# EAGLE design RC_Engine_Sound_ESP32_B (EAGLE 9.6.2)
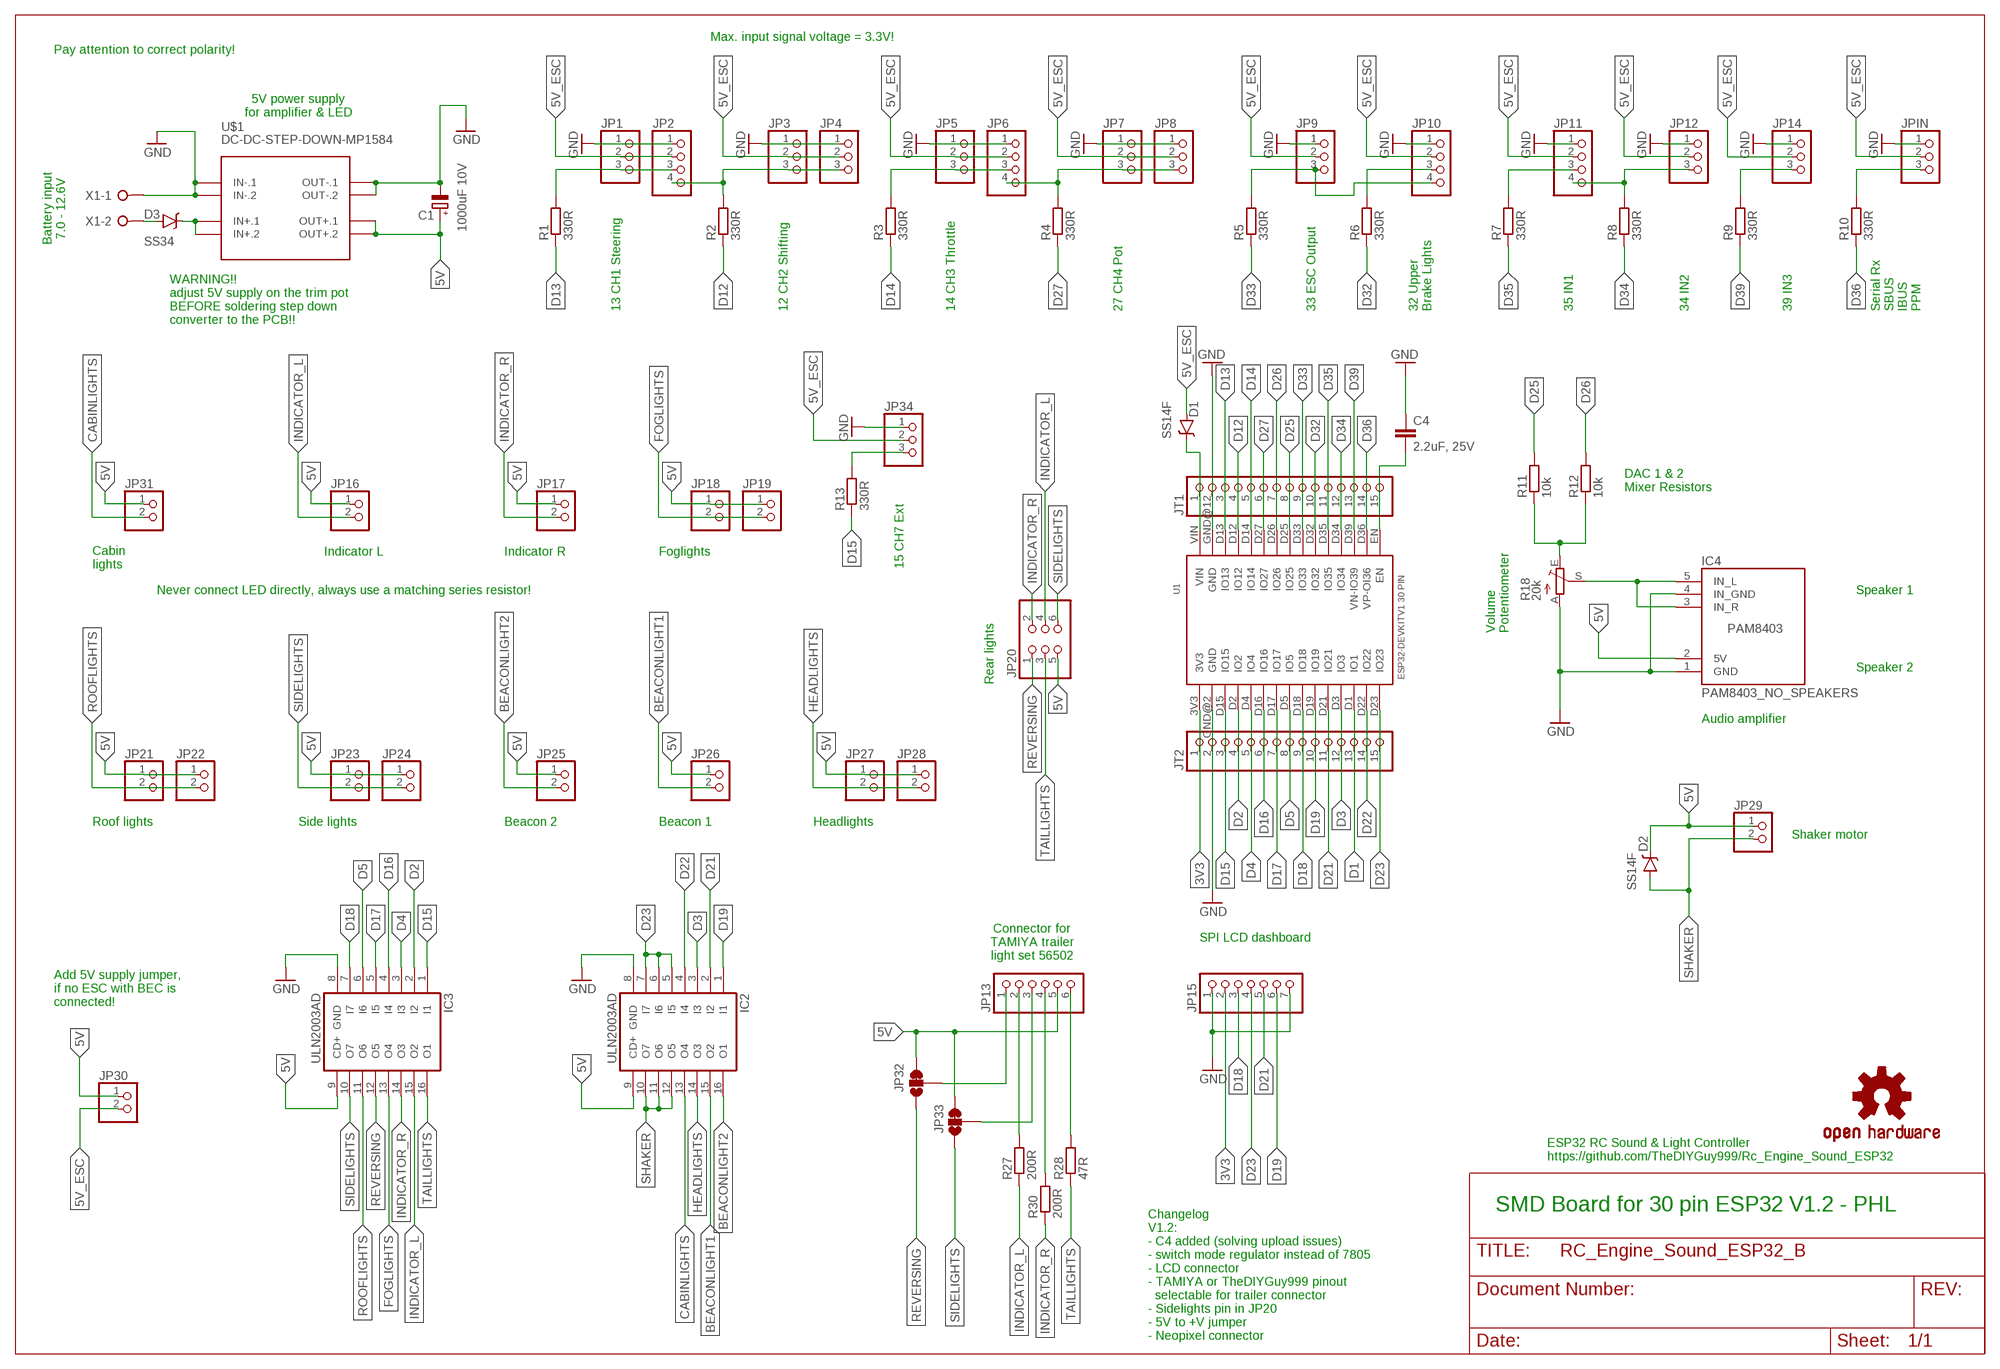
[diagram p0: schematic, sheet 1]

## Parts
C1  1000uF 10V  CPOL-EUUD-10X10  [UD-10X10_NICHICON]
C4  2.2uF, 25V  C-EUC1206  [C1206]
D1  SS14F  MBRA140  [SMA-DIODE]
D2  SS14F  MBRA140  [SMA-DIODE]
D3  SS34  MBRA140  [SMA-DIODE]
IC2  ULN2003AD  [SO16]
IC3  ULN2003AD  [SO16]
IC4  PAM8403_NO_SPEAKERS  [PAM8403_NO_SPEAKERS]
JP1  PINHD-1X3  [1X03]
JP2  00_CUSTOM_PINHEAD_PINHD-1X4  [00_CUSTOM_PINHEAD_1X04]
JP3  PINHD-1X3  [1X03]
JP4  PINHD-1X3  [1X03]
JP5  PINHD-1X3  [1X03]
JP6  00_CUSTOM_PINHEAD_PINHD-1X4  [00_CUSTOM_PINHEAD_1X04]
JP7  PINHD-1X3  [1X03]
JP8  PINHD-1X3  [1X03]
JP9  PINHD-1X3  [1X03]
JP10  00_CUSTOM_PINHEAD_PINHD-1X4  [00_CUSTOM_PINHEAD_1X04]
JP11  00_CUSTOM_PINHEAD_PINHD-1X4  [00_CUSTOM_PINHEAD_1X04]
JP12  PINHD-1X3  [1X03]
JP13  PINHD-1X6  [1X06]
JP14  PINHD-1X3  [1X03]
JP15  PINHD-1X7  [1X07]
JP16  PINHD-1X2  [1X02]
JP17  PINHD-1X2  [1X02]
JP18  PINHD-1X2  [1X02]
JP19  PINHD-1X2  [1X02]
JP20  PINHD-2X3  [2X03]
JP21  PINHD-1X2  [1X02]
JP22  PINHD-1X2  [1X02]
JP23  PINHD-1X2  [1X02]
JP24  PINHD-1X2  [1X02]
JP25  PINHD-1X2  [1X02]
JP26  PINHD-1X2  [1X02]
JP27  PINHD-1X2  [1X02]
JP28  PINHD-1X2  [1X02]
JP29  PINHD-1X2  [1X02]
JP30  PINHD-1X2  [1X02]
JP31  PINHD-1X2  [1X02]
JP32  JUMPER-PAD-3-2OF3_NC_BY_TRACE_LARGE  [PAD-JUMPER-3-2OF3_NC_BY_TRACE_YES_SILK_LARGE]
JP33  JUMPER-PAD-3-2OF3_NC_BY_TRACE_LARGE  [PAD-JUMPER-3-2OF3_NC_BY_TRACE_YES_SILK_LARGE]
JP34  PINHD-1X3  [1X03]
JPIN  PINHD-1X3  [1X03]
JT1  00_CUSTOM_PINHEAD_PINHD-1X15  [00_CUSTOM_PINHEAD_1X15]
JT2  00_CUSTOM_PINHEAD_PINHD-1X15  [00_CUSTOM_PINHEAD_1X15]
LOGO1  OSHW-LOGOM  [OSHW-LOGO-M]
R1  330R  R-EU_R0805  [R0805]
R2  330R  R-EU_R0805  [R0805]
R3  330R  R-EU_R0805  [R0805]
R4  330R  R-EU_R0805  [R0805]
R5  330R  R-EU_R0805  [R0805]
R6  330R  R-EU_R0805  [R0805]
R7  330R  R-EU_R0805  [R0805]
R8  330R  R-EU_R0805  [R0805]
R9  330R  R-EU_R0805  [R0805]
R10  330R  R-EU_R0805  [R0805]
R11  10k  R-EU_R0805  [R0805]
R12  10k  R-EU_R0805  [R0805]
R13  330R  R-EU_R0805  [R0805]
R18  20k  TRIM_EU-S64W  [S64W]
R27  200R  R-EU_R0805  [R0805]
R28  47R  R-EU_R0805  [R0805]
R30  200R  R-EU_R0805  [R0805]
U1  ESP32DEVKITV1  [ESP32-DEVKITV1]
U$1  DC-DC-STEP-DOWN-MP1584  [DC-DC-STEP-DOWN-MP1584]
X1  W237-02P  [W237-132]

## Nets
3V3: JP15.2 JT2.1 U1.3V3
5V: C1.+ D2.C IC2.9(CD+) IC3.9(CD+) IC4.2(5V) JP13.5 JP16.1 JP17.1 JP18.1 JP19.1 JP20.5 JP21.1 JP22.1 JP23.1 JP24.1 JP25.1 JP26.1 JP27.1 JP28.1 JP29.1 JP30.1 JP31.1 JP32.3 JP33.3 U$1.OUT+.1 U$1.OUT+.2
5V_ESC: D1.A JP1.2 JP2.2 JP3.2 JP4.2 JP5.2 JP6.2 JP7.2 JP8.2 JP9.2 JP10.2 JP11.2 JP12.2 JP14.2 JP30.2 JP34.2 JPIN.2
BEACONLIGHT1: IC2.15(O2) JP26.2
BEACONLIGHT2: IC2.16(O1) JP25.2
CABINLIGHTS: IC2.13(O4) JP31.2
D1: JT2.13 U1.D1(IO1)
D2: IC3.2(I2) JT2.4 U1.D2(IO2)
D3: IC2.3(I3) JT2.12 U1.D3(IO3)
D4: IC3.3(I3) JT2.5 U1.D4(IO4)
D5: IC3.6(I6) JT2.8 U1.D5(IO5)
D12: JT1.4 R2.1 U1.D12(IO12)
D13: JT1.3 R1.1 U1.D13(IO13)
D14: JT1.5 R3.1 U1.D14(IO14)
D15: IC3.1(I1) JT2.3 R13.1 U1.D15(IO15)
D16: IC3.4(I4) JT2.6 U1.D16(IO16)
D17: IC3.5(I5) JT2.7 U1.D17(IO17)
D18: IC3.7(I7) JP15.3 JT2.9 U1.D18(IO18)
D19: IC2.1(I1) JP15.6 JT2.10 U1.D19(IO19)
D21: IC2.2(I2) JP15.5 JT2.11 U1.D21(IO21)
D22: IC2.4(I4) JT2.14 U1.D22(IO22)
D23: IC2.5(I5) IC2.6(I6) IC2.7(I7) JP15.4 JT2.15 U1.D23(IO23)
D25: JT1.8 R11.2 U1.D25(IO25)
D26: JT1.7 R12.2 U1.D26(IO26)
D27: JT1.6 R4.1 U1.D27(IO27)
D32: JT1.10 R6.1 U1.D32(IO32)
D33: JT1.9 R5.1 U1.D33(IO33)
D34: JT1.12 R8.1 U1.D34(IO34)
D35: JT1.11 R7.1 U1.D35(IO35)
D36: JT1.14 R10.1 U1.D36(VP-OI36)
D39: JT1.13 R9.1 U1.D39(VN-IO39)
FOGLIGHTS: IC3.13(O4) JP18.2 JP19.2
GND: C1.- C4.1 IC2.8(GND) IC3.8(GND) IC4.1(GND) IC4.4(IN_GND) JP1.1 JP2.1 JP3.1 JP4.1 JP5.1 JP6.1 JP7.1 JP8.1 JP9.1 JP10.1 JP11.1 JP12.1 JP14.1 JP15.1 JP15.7 JP34.1 JPIN.1 JT1.2 JT2.2 R18.A U1.GND@1(GND) U1.GND@2(GND) U$1.IN-.1 U$1.IN-.2 U$1.OUT-.1 U$1.OUT-.2 X1.1
HEADLIGHTS: IC2.14(O3) JP27.2 JP28.2
INDICATOR_L: IC3.15(O2) JP16.2 JP20.4 R27.1
INDICATOR_R: IC3.14(O3) JP17.2 JP20.2 R30.1
N$1: IC4.3(IN_R) IC4.5(IN_L) R18.S
N$2: R11.1 R12.1 R18.E
N$3: JP1.3 JP2.3 R1.2
N$4: JP13.6 R28.2
N$5: JP2.4 JP3.3 JP4.3 R2.2
N$6: JP5.3 JP6.3 R3.2
N$7: JP6.4 JP7.3 JP8.3 R4.2
N$8: JP9.3 JP10.4 R5.2
N$9: D1.C JT1.1 U1.VIN
N$10: JP10.3 R6.2
N$11: JP11.3 R7.2
N$12: JP11.4 JP12.3 R8.2
N$13: JP13.4 R30.2
N$14: JPIN.3 R10.2
N$15: JP13.2 R27.2
N$16: JP13.1 JP32.2
N$17: C4.2 JT1.15 U1.EN
N$18: JP13.3 JP33.2
N$19: D3.C U$1.IN+.1 U$1.IN+.2
N$20: D3.A X1.2
N$21: JP14.3 R9.2
N$23: JP34.3 R13.2
REVERSING: IC3.12(O5) JP20.1 JP32.1
ROOFLIGHTS: IC3.11(O6) JP21.2 JP22.2
SHAKER: D2.A IC2.10(O7) IC2.11(O6) IC2.12(O5) JP29.2
SIDELIGHTS: IC3.10(O7) JP20.6 JP23.2 JP24.2 JP33.1
TAILLIGHTS: IC3.16(O1) JP20.3 R28.1

## Notes on the sheet
- Max. input signal voltage = 3.3V!
- Pay attention to correct polarity!
- 5V power supply
  for amplifier & LED
- Battery input
  7.0 - 12.6V
- 13 CH1 Steering | 12 CH2 Shifting | 14 CH3 Throttle | 27 CH4 Pot | 33 ESC Output
- 32 Upper
  Brake Lights
- 35 IN1 | 34 IN2 | 39 IN3
- Serial Rx
  SBUS
  IBUS
  PPM
- WARNING!!
  adjust 5V supply on the trim pot
  BEFORE soldering step down
  converter to the PCB!!
- DAC 1 & 2
  Mixer Resistors
- Indicator L | Indicator R | Foglights
- Cabin
  lights
- 15 CH7 Ext
- Never connect LED directly, always use a matching series resistor! | Speaker 1
- Volume
  Potentiometer
- Speaker 2
- Rear lights
- Audio amplifier
- Roof lights | Side lights | Beacon 2 | Beacon 1 | Headlights
- Shaker motor
- Connector for
  TAMIYA trailer
  light set 56502
- SPI LCD dashboard
- Add 5V supply jumper,
  if no ESC with BEC is
  connected!
- ESP32 RC Sound & Light Controller
  https://github.com/TheDIYGuy999/Rc_Engine_Sound_ESP32
- SMD Board for 30 pin ESP32 V1.2 - PHL
- Changelog
  V1.2:
  - C4 added (solving upload issues)
  - switch mode regulator instead of 7805
  - LCD connector
  - TAMIYA or TheDIYGuy999 pinout
    selectable for trailer connector
  - Sidelights pin in JP20
  - 5V to +V jumper
  - Neopixel connector

## Library data of the parts
C1 = rcl:CPOL-EU: POLARIZED CAPACITOR, European symbol; SPICEPREFIX: C
C4 = rcl:C-EU: CAPACITOR, European symbol
D1-D3 = SparkFun-DiscreteSemi:MBRA140: 40V, 1A Schottky rectifier SMA/DO-214AC package DIO-08053; PROD_ID: DIO-08053
IC2 IC3 = uln-udn:ULN2003A: DRIVER ARRAY
IC4 = 00_custom:PAM8403_NO_SPEAKERS
JP1 JP3-JP5 JP7-JP9 JP12 JP14 JP34 JPIN = 00_custom_pinhead:PINHD-1X3: PIN HEADER
JP2 JP6 JP10 JP11 = RC_Engine_Sound_ESP32:00_CUSTOM_PINHEAD_PINHD-1X4: PIN HEADER
JP13 = 00_custom_pinhead:PINHD-1X6: PIN HEADER
JP15 = 00_custom_pinhead:PINHD-1X7: PIN HEADER
JP16-JP19 JP21-JP31 = 00_custom_pinhead:PINHD-1X2: PIN HEADER
JP20 = 00_custom_pinhead:PINHD-2X3: PIN HEADER
JP32 JP33 = SparkFun-Passives:JUMPER-PAD-3-2OF3_NC_BY_TRACE
JT1 JT2 = RC_Engine_Sound_ESP32:00_CUSTOM_PINHEAD_PINHD-1X15
LOGO1 = SparkFun-Aesthetics:OSHW-LOGO: Open Source Hardware Logo This logo indicates the piece of hardware it is found on incorporates a OSHW license and/or adheres to the definition of open source hardware found here: http://freedomdefined.org/OSHW
R1-R13 R27 R28 R30 = rcl:R-EU_: RESISTOR, European symbol; SPICEPREFIX: R
R18 = pot:TRIM_EU-: POTENTIOMETER
U1 = ESP32-DEVKITV1_30pin:ESP32DEVKITV1
U$1 = 00_custom:DC-DC-STEP-DOWN-MP1584: DC/DC Step-Down Regulator based on MP1584 chip MP1584 datasheet available here: http://www.haoyuelectronics.com/Attachment/MP1584/MP1584.pdf Click here to find device on ebay.com <http://www.ebay.com/sch/mp1584+module>
X1 = con-wago-508:W237-02P: WAGO SREW CLAMP; OC_FARNELL: unknown; OC_NEWARK: unknown

## Net classes
0 5V: clearance 0.254 mm

## Board
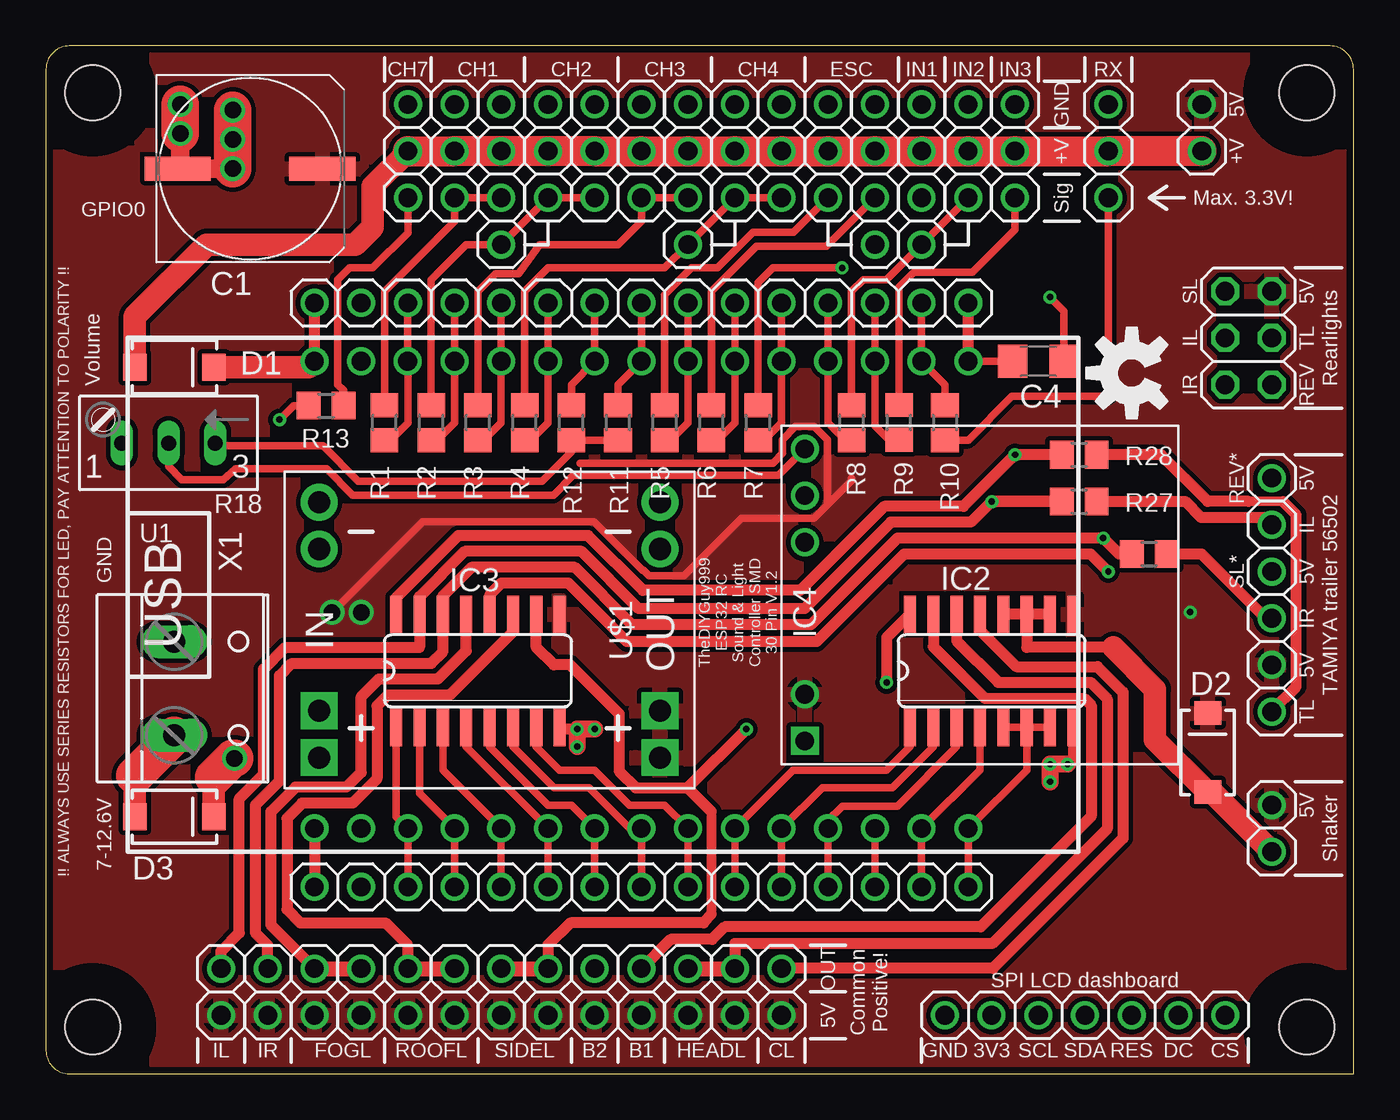
[diagram p1: board, top side]
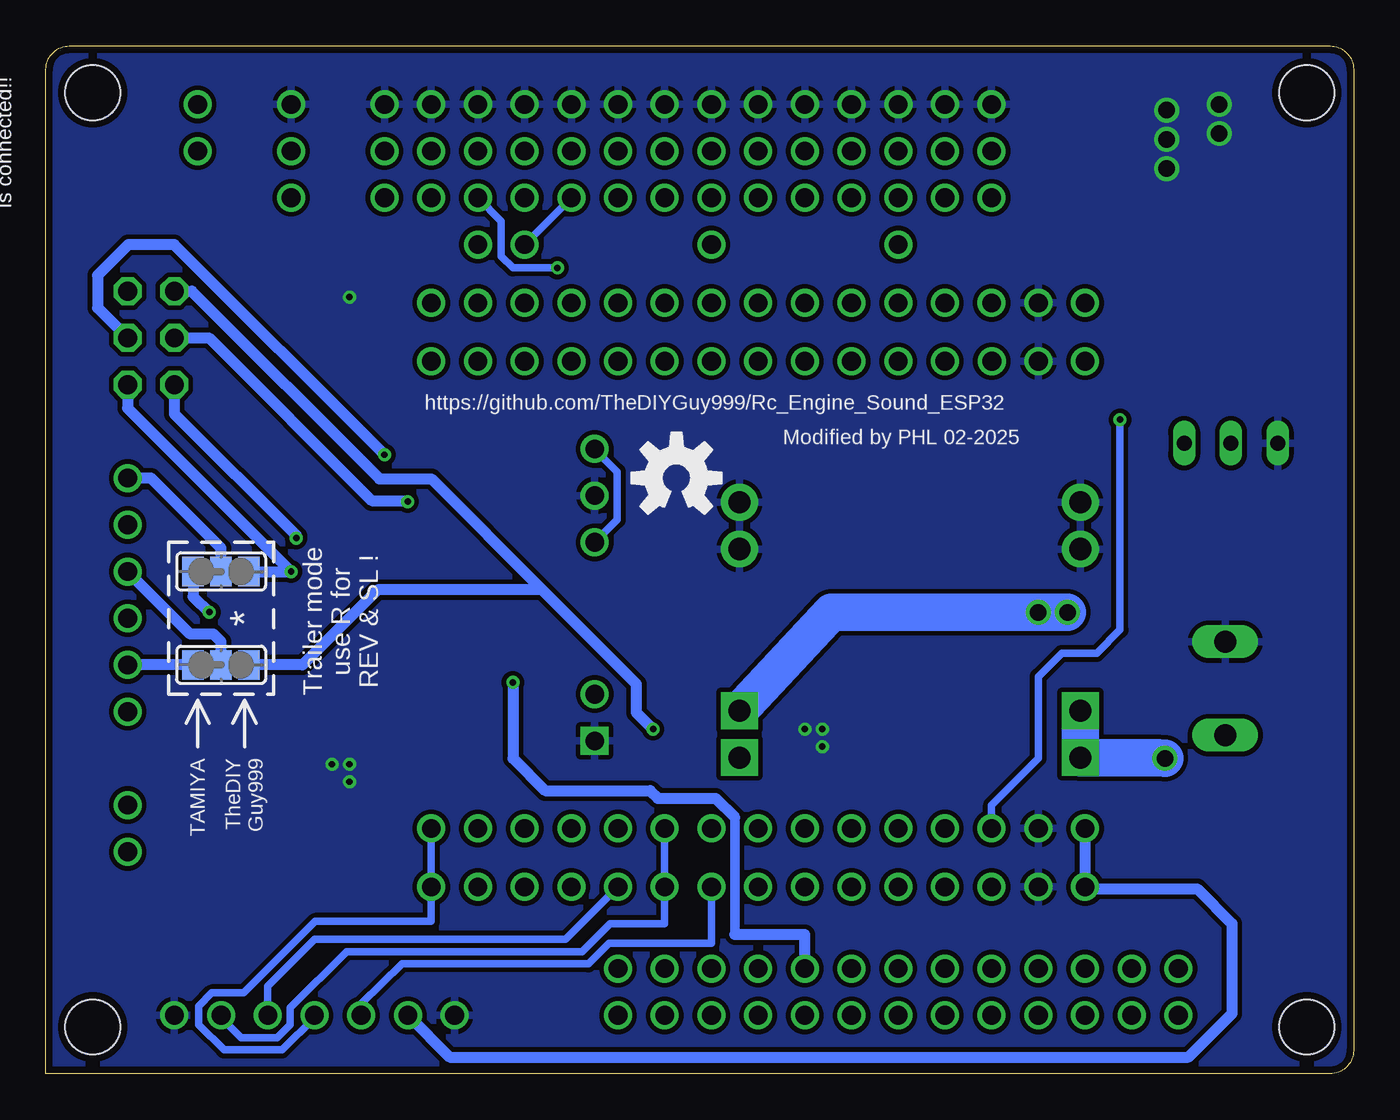
[diagram p2: board, bottom side, seen from below]

Size 71.12 x 55.88 mm. Coordinates in mm from the lower left corner, seen from the top.
Outline: 0,54.61 0,1.27 arc90 1.27,0 71.12,0 71.12,54.61 arc90 69.85,55.88 1.27,55.88 arc90 0,54.61
Copper layers (1*16): Top 0.0356mm / dielectric 1.5011mm / Bottom 0.0356mm
Design rules "OSHPark_LaenPCBOrder": minimum track width 6mil, minimum drill 13mil, track to track 6mil, track to pad 6mil, pad to pad 6mil, via to via 6mil, smd to smd 6mil, copper to edge 15mil, drill to drill 6mil, minimum pad ring 7mil, minimum via ring 7mil, stop-mask expansion 3mil, vias tented up to drill 0mil, thermal gap 10mil
Holes 3 mm at 2.54,53.34 2.54,2.54 68.58,2.54 68.58,53.34
tRestrict: area -0.7,50.1 to 5.8,56.6; area 65.3,50.1 to 71.8,56.6; area 65.3,-0.7 to 71.8,5.8; area -0.7,-0.7 to 5.8,5.8

### Footprints (pad centres in the part's own frame; a part is rotated, then mirrored left to right if it is on the bottom)
UD-10X10_NICHICON = smd 3.6 x 1.3: + 3.925,0; - -3.95,0
C1206 = smd 1.6 x 1.8: 1 -1.4,0; 2 1.4,0
SMA-DIODE = smd 1.27 x 1.47: A -2.15,0; C 2.15,0
SO16 = smd 0.66 x 2.032: 1 -4.445,-3.073; 2 -3.175,-3.073; 3 -1.905,-3.073; 4 -0.635,-3.073; 5 0.635,-3.073; 6 1.905,-3.073; 7 3.175,-3.073; 8 4.445,-3.073; 9 4.445,3.073; 10 3.175,3.073; 11 1.905,3.073; 12 0.635,3.073; 13 -0.635,3.073; 14 -1.905,3.073; 15 -3.175,3.073; 16 -4.445,3.073
PAM8403_NO_SPEAKERS = drill 1.016 square: 1 -7.62,8.89 | drill 1.016: 2 -5.08,8.89; 3 3.175,8.89; 4 5.715,8.89; 5 8.255,8.89
1X03 = drill 1.016 pad 1.524: 1 -2.54,0; 2 0,0; 3 2.54,0
00_CUSTOM_PINHEAD_1X04 = drill 1.016 pad 1.524: 1 -2.54,0; 2 0,0; 3 2.54,0; 4 5.08,0
1X06 = drill 1.016 pad 1.524: 1 -6.35,0; 2 -3.81,0; 3 -1.27,0; 4 1.27,0; 5 3.81,0; 6 6.35,0
1X07 = drill 1.016: 1 -7.62,0; 2 -5.08,0; 3 -2.54,0; 4 0,0; 5 2.54,0; 6 5.08,0; 7 7.62,0
1X02 = drill 1.016 pad 1.524: 1 -1.27,0; 2 1.27,0
2X03 = drill 1.016 octagon: 1 -2.54,-1.27; 2 -2.54,1.27; 3 0,-1.27; 4 0,1.27; 5 2.54,-1.27; 6 2.54,1.27
PAD-JUMPER-3-2OF3_NC_BY_TRACE_YES_SILK_LARGE = smd 1.168 x 1.6: 1 -1.524,0; 2 0,0; 3 1.524,0
00_CUSTOM_PINHEAD_1X15 = drill 1.016: 1 -7.62,0; 2 -5.08,0; 3 -2.54,0; 4 0,0; 5 2.54,0; 6 5.08,0; 7 7.62,0; 8 10.16,0; 9 12.7,0; 10 15.24,0; 11 17.78,0; 12 20.32,0; 13 22.86,0; 14 25.4,0; 15 27.94,0
R0805 = smd 1.3 x 1.5: 1 -0.95,0; 2 0.95,0
S64W = drill 0.813 long: A 2.54,1.27; E -2.54,1.27; S 0,1.27
ESP32-DEVKITV1 = drill 1.016: 3V3 -16.51,-12.7; D1 13.97,-12.7; D2 -8.89,-12.7; D3 11.43,-12.7; D4 -6.35,-12.7; D5 1.27,-12.7; D12 -8.89,12.7; D13 -11.44,12.7; D14 -6.35,12.7; D15 -11.43,-12.7; D16 -3.81,-12.7; D17 -1.27,-12.7; D18 3.81,-12.7; D19 6.35,-12.7; D21 8.89,-12.7; D22 16.51,-12.7; D23 19.05,-12.7; D25 1.27,12.7; D26 -1.27,12.7; D27 -3.81,12.7; D32 6.35,12.7; D33 3.81,12.7; D34 11.43,12.7; D35 8.89,12.7; D36 16.51,12.7; D39 13.97,12.7; EN 19.05,12.7; GND@1 -13.97,12.7; GND@2 -13.97,-12.7; VIN -16.51,12.7
DC-DC-STEP-DOWN-MP1584 = drill 1.2 pad 2 square: IN+.1 -9.271,-4.4; IN+.2 -9.271,-6.94; OUT+.1 9.271,-4.4; OUT+.2 9.271,-6.94 | drill 1.2 pad 2: IN-.1 -9.271,6.94; IN-.2 -9.271,4.4; OUT-.1 9.271,6.94; OUT-.2 9.271,4.4
W237-132 = drill 1.194 long: 1 -2.54,-0.635; 2 2.54,-0.635

### Placement (x,y rotation side)
C1  11.11,49.21 0 top
C4  53.98,38.73 180 top
D1  6.98,38.42 0 top
D2  63.18,17.46 90 top
D3  6.98,13.97 0 top
IC2  51.43,21.91 0 top
IC3  23.5,21.91 0 top
IC4  50.16,25.72 90 top
JP1  22.23,50.16 270 top
JP2  24.77,50.16 270 top
JP3  27.31,50.16 270 top
JP4  29.85,50.16 270 top
JP5  32.38,50.16 270 top
JP6  34.92,50.16 270 top
JP7  37.46,50.16 270 top
JP8  40,50.16 270 top
JP9  42.54,50.16 270 top
JP10  45.09,50.16 270 top
JP11  47.62,50.16 270 top
JP12  50.16,50.16 270 top
JP13  66.68,26.04 270 top
JP14  52.7,50.16 270 top
JP15  56.52,3.17 0 top
JP16  9.53,4.45 90 top
JP17  12.06,4.45 90 top
JP18  14.61,4.45 90 top
JP19  17.15,4.45 90 top
JP20  65.41,40 90 top
JP21  19.69,4.45 90 top
JP22  22.23,4.45 90 top
JP23  24.77,4.45 90 top
JP24  27.31,4.45 90 top
JP25  29.85,4.45 90 top
JP26  32.38,4.45 90 top
JP27  34.92,4.45 90 top
JP28  37.46,4.45 90 top
JP29  66.68,13.33 270 top
JP30  62.86,51.43 270 top
JP31  40,4.45 90 top
JP32  61.59,27.31 180 bottom
JP33  61.59,22.23 180 bottom
JP34  19.69,50.16 270 top
JPIN  57.78,50.16 270 top
JT1  22.23,41.91 0 top
JT2  22.23,10.16 0 top
LOGO1  59.05,38.1 90 top
LOGO2  OSHW-LOGOM  [OSHW-LOGO-M]  36.83,32.38 0 bottom
R1  18.42,35.4 90 top
R2  20.96,35.4 90 top
R3  23.5,35.4 90 top
R4  26.04,35.4 90 top
R5  33.66,35.4 90 top
R6  36.2,35.4 90 top
R7  38.73,35.4 90 top
R8  43.81,35.4 90 top
R9  46.4,35.41 90 top
R10  48.89,35.4 270 top
R11  31.12,35.4 90 top
R12  28.58,35.4 90 top
R13  15.24,36.32 0 top
R18  6.67,35.56 180 top
R27  56.2,31.12 0 top
R28  56.2,33.66 0 top
R30  60.01,28.26 0 top
U1  31.12,26.04 0 top
U$1  24.13,24.13 0 top
X1  7.62,20.96 270 top

### Tracks (layer width: path | path; a pad name or v marks a point on that pad's centre or on a via)
3V3
  Top 0.61: U1.3V3 JT2.1
  Bottom 0.61: U1.3V3 14.61,10.05 8.5,10.05 6.62,8.17 6.62,3.26 8.98,0.9 49.16,0.9 JP15.2
5V  (via drill 0.35, 0.9)
  Top 0.406: v15.56,25.08 20.5,30.02 29.81,30.02 32.45,27.37 32.5,27.37 32.8,27.07 34.69,27.07 37.83,30.21 41.78,30.21 42.49,30.93 | 42.49,30.93 42.49,34.48 41.78,35.19 40.77,35.19 40.06,34.48 40.06,33.73 39.53,33.2 29.05,33.2 | 42.49,30.93 43.81,32.25 43.81,32.38
  Bottom 0.61: JP33.3 JP13.5 | JP32.3 63.12,25.94 v62.23,25.1
  Bottom 2.032: U$1.OUT+.1 28.39,25.08 v17.15,25.08 v15.56,25.08
  pour Top: 73.03,-1.78 -1.92,-1.78 -1.24,57.78 73.03,57.78
5V_ESC
  Top 1.219: D1.A 4.83,41.19 8.73,45.09 16.83,45.09 17.78,46.04 17.78,48.26 JP34.2
  Top 1.626: JP30.2 JPIN.2 JP14.2 JP12.2 JP11.2 JP10.2 JP9.2 JP8.2 JP7.2 JP6.2 JP5.2 JP4.2 JP3.2 JP2.2 JP1.2 JP34.2
BEACONLIGHT1
  Top 0.61: IC2.15 48.26,23.23 51.08,20.41 56.48,20.41 56.86,20.03 56.86,13.99 50.85,7.99 36.92,7.99 36.23,7.3 33.97,7.3 JP26.2
BEACONLIGHT2  (via drill 0.35)
  Top 0.61: IC2.16 45.72,23.71 v45.72,21.27
  Bottom 0.508: 33.66,13.93 33.66,7.57
  Bottom 0.61: v45.72,21.27 45.72,17.15 43.97,15.4 38.26,15.4 37.83,14.97 34.7,14.97 33.66,13.93 | 33.66,7.57 29.85,7.57 JP25.2
CABINLIGHTS
  Top 0.61: JP31.2 40.02,5.73 51.52,5.73 58.58,12.8 58.58,20.74 57.19,22.14 52.78,22.14 50.8,24.11 IC2.13
D1
  Top 0.406: U1.D1 JT2.13
D2
  Top 0.406: IC3.2 20.32,15.24 U1.D2 JT2.4
D3
  Top 0.406: IC2.3 49.53,17.78 46.3,14.55 43.31,14.55 42.54,13.79 U1.D3 JT2.12
D4
  Top 0.406: IC3.3 21.59,16.51 U1.D4 JT2.5
D5
  Top 0.406: IC3.6 25.4,17.78 27.62,15.56 29.53,15.56 31.75,13.33 U1.D5 JT2.8
D12
  Top 0.406: R2.1 21.28,34.45 22.23,35.4 U1.D12 JT1.4
D13
  Top 0.406: R1.1 18.74,34.45 19.69,35.4 U1.D13 JT1.3
  Top 0.61: JT1.3
D14
  Top 0.406: R3.1 23.82,34.45 24.77,35.4 U1.D14 JT1.5
D15  (via drill 0.35)
  Top 0.406: IC3.1 19.05,13.97 U1.D15 JT2.3 | R13.1 13.46,36.32 v12.7,35.56
  Bottom 0.406: U1.D15 19.69,14.61 17.15,17.15 17.15,21.59 15.88,22.86 13.97,22.86 12.7,24.13 v12.7,35.56
D16
  Top 0.406: IC3.4 22.86,17.78 U1.D16 JT2.6
D17
  Top 0.406: IC3.5 24.13,17.78 27.31,14.61 28.58,14.61 U1.D17 JT2.7
D18
  Top 0.406: IC3.7 26.67,17.78 27.94,16.51 29.85,16.51 31.75,14.61 33.66,14.61 U1.D18 JT2.9
  Bottom 0.406: JT2.9 34.92,7.09 40.49,7.09 41.62,5.97 51.75,5.97 53.98,3.81 JP15.3
D19
  Top 0.406: IC2.1 46.99,17.78 45.72,16.51 40.64,16.51 U1.D19 JT2.10
  Bottom 0.406: U1.D19 37.46,8.15 40.45,8.15 41.95,6.64 54.77,6.64 57.84,3.58 57.84,2.67 58.55,1.96 60.51,1.96 61.59,3.04 JP15.6
D21
  Top 0.406: IC2.2 48.26,17.78 46.04,15.56 42.23,15.56 U1.D21 JT2.11
  Bottom 0.406: JP15.5 59.05,4.76 56.52,7.3 42.86,7.3 JT2.11
D22
  Top 0.406: IC2.4 50.8,16.51 U1.D22 JT2.14
D23
  Top 0.406: IC2.7 IC2.6 | IC2.6 IC2.5 | IC2.6 53.34,16.51 U1.D23 JT2.15
  Bottom 0.406: U1.D23 50.16,8.28 56.47,8.28 60.36,4.39 62.1,4.39 62.81,3.68 62.81,2.67 61.44,1.29 58.28,1.29 56.52,3.06 JP15.4
D25
  Top 0.406: R11.2 31.12,37.46 U1.D25 JT1.8
D26
  Top 0.406: R12.2 28.58,37.46 U1.D26 JT1.7
D27
  Top 0.406: R4.1 26.36,34.45 27.31,35.4 U1.D27 JT1.6
D32
  Top 0.406: R6.1 36.52,34.45 37.46,35.4 U1.D32 JT1.10
D33
  Top 0.406: R5.1 33.98,34.45 34.92,35.4 U1.D33 JT1.9
D34
  Top 0.406: 42.54,37.46 U1.D34 JT1.12 | 42.54,37.46 42.54,35.4 43.49,34.45 R8.1 | 42.54,37.46
D35
  Top 0.406: R7.1 39.05,34.45 40,35.4 U1.D35 JT1.11
D36
  Top 0.406: R10.1 48.89,37.46 U1.D36 JT1.14
D39
  Top 0.152: 45.85,34.46 R9.1
  Top 0.406: JT1.13 U1.D39 45.09,35.23 45.85,34.46
FOGLIGHTS
  Top 0.61: IC3.13 22.86,23 21.31,21.45 18.1,21.45 17.15,20.5 17.15,16.39 16.34,15.58 13.57,15.58 12.24,14.24 12.24,8.08 JP18.2
  Top 0.813: JP18.2 JP19.2
GND  (via drill 0.35, 0.9)
  Top 0.406: v54.61,42.23 55.38,41.46 C4.1
  Top 0.61: IC2.8 55.88,17.15 v55.56,16.83 | v28.89,18.73 28.04,18.73 IC3.8
  Top 0.914: v55.56,16.83 v54.61,16.83 v54.61,15.88 | v29.85,18.73 v28.89,18.73 v28.89,17.78
  Top 1.016: v7.3,51.12 7.3,49.35 C1.- v10.16,49.21
  Top 2.032: v10.16,49.21 v10.16,52.39 | v7.3,51.12 v7.3,52.7
  other vias: 10.16,50.8
  pour Bottom: -0.64,56.52 71.76,56.52 71.76,-0.64 -0.64,-0.64
HEADLIGHTS
  Top 0.61: JP28.2 37.46,7.07 51.48,7.07 57.72,13.32 57.72,20.39 56.83,21.27 51.8,21.27 49.53,23.54 IC2.14
  Top 0.813: JP27.2 JP28.2
INDICATOR_L  (via drill 0.35)
  Top 0.61: v51.45,31.1 51.46,31.12 R27.1 v51.44,31.12 50.31,29.99 45.96,29.99 41.26,25.29 32.24,25.29 29.13,28.4 22.78,28.4 20.32,25.94 IC3.15 20.32,23.18 13.02,23.18 11.84,22 11.84,16.28 10.52,14.96 10.52,7.66 9.53,6.67 JP16.2
  Bottom 0.61: JP20.4 62.25,40 53.4,31.16 51.48,31.16 v51.43,31.12 v51.45,31.1
INDICATOR_R  (via drill 0.35)
  Top 0.61: R30.1 58.37,28.26 v57.51,29.12 46.31,29.12 41.62,24.42 31.88,24.42 28.77,27.53 23.14,27.53 21.59,25.99 IC3.14 21.59,22.95 20.96,22.31 13.38,22.31 12.7,21.64 12.7,15.92 11.38,14.6 11.38,7.67 12.06,6.98 JP17.2
  Bottom 0.61: JP20.2 64.14,35.88 57.47,29.21 57.47,29.16 v57.51,29.12
N$1
  Top 0.406: IC4.5 39.85,32.54 28.68,32.54 27.6,31.46 16.67,31.46 15.26,32.89 10.31,32.89 9.65,32.3 7.39,32.3 6.67,33.02 R18.S
  Bottom 0.406: IC4.5 41.27,33.95 40.06,32.73 40.06,30.11 IC4.3
N$2
  Top 0.406: R11.1 R12.1 28.58,33.82 26.99,32.23 16.99,32.23 15.08,34.13 9.37,34.13 R18.E
N$3
  Top 0.406: R1.2 18.42,42.54 22.23,46.35 JP1.3 JP2.3
N$4
  Top 0.508: 67.27,31.12 65.41,31.12
  Top 0.61: 67.27,31.12 68,30.39 68,21.04 66.68,19.72 JP13.6 | 65.41,31.12 63.18,31.12 60.64,33.66 R28.2
N$5
  Top 0.406: R2.2 20.96,43.18 22.86,45.09 JP2.4 JP3.3 JP4.3
N$6
  Top 0.406: R3.2 23.5,42.54 24.45,43.5 25.72,43.5 26.85,45.09 31.12,45.09 32.38,46.35 JP5.3 JP6.3
N$7
  Top 0.406: R4.2 26.04,42.54 27.31,43.81 33.66,43.81 JP6.4 JP7.3 JP8.3
N$8
  Top 0.406: R5.2 33.66,42.36 35.11,43.81 36.53,43.81 38.46,45.74 40.66,45.74 JP9.3
  Bottom 0.406: JP9.3 JP10.4
N$9
  Top 0.61: U1.VIN JT1.1
  Top 1.219: D1.C 14.29,38.42 U1.VIN
N$10
  Top 0.406: R6.2 36.2,42.54 38.64,44.99 42.45,44.99 JP10.3
N$11  (via drill 0.35)
  Top 0.406: R7.2 38.73,43 39.55,43.81 v43.31,43.81
  Bottom 0.406: v43.31,43.81 45.72,43.81 46.35,44.45 46.35,46.35 JP11.3
N$12
  Top 0.406: JP12.3 JP11.4 45.72,43.18 44.45,43.18 43.81,42.54 R8.2
N$13
  Top 0.61: R30.2 62.86,28.26 66.36,24.77 JP13.4
N$14
  Top 0.406: R10.2 50.16,34.45 52.54,36.83 57.78,36.83 JPIN.3
N$15
  Top 0.61: JP13.2 66.27,30.25 62.82,30.25 61.96,31.12 R27.2
N$16
  Bottom 0.61: JP32.2 61.59,28.58 65.41,32.38 JP13.1
N$17
  Top 0.406: U1.EN C4.2
  Top 0.61: U1.EN JT1.15
N$18
  Bottom 0.61: JP33.2 61.59,23.5 62,23.9 63.27,23.9 JP13.3
N$19  (via drill 0.9)
  Top 1.219: D3.C 9.13,16.12
  Top 2.032: 9.13,16.12 10.16,17.15 v10.26,17.15
  Bottom 2.032: U$1.IN+.1 U$1.IN+.2 10.64,17.19 v10.26,17.15
N$20
  Top 1.219: D3.A 4.83,16.19
  Top 2.032: 4.83,16.19 6.98,18.34 X1.2
N$21
  Top 0.406: 52.7,47.46 JP14.3 52.7,45.9 50.39,43.59 47.21,43.59 46.4,42.77 R9.2
N$23
  Top 0.406: R13.2 16.19,37.15 15.88,37.46 15.88,43.18 16.51,43.81 17.78,43.81 19.69,45.72 JP34.3
REVERSING  (via drill 0.35)
  Top 0.61: v57.78,27.31 56.83,28.26 46.67,28.26 41.91,23.5 31.59,23.5 28.42,26.67 24.77,26.67 24.13,26.04 IC3.12
  Bottom 0.61: JP20.1 66.68,36.2 v57.78,27.31 JP32.1
ROOFLIGHTS
  Top 0.61: IC3.11 25.4,24.03 21.96,20.59 18.59,20.59 18.01,20 18.01,16.03 16.69,14.71 13.93,14.71 13.11,13.89 13.11,8.93 13.83,8.2 18.47,8.2 19.69,6.98 JP21.2
  Top 0.813: JP21.2 JP22.2
SHAKER
  Top 0.61: IC2.10 IC2.11 | IC2.11 IC2.12 | IC2.11 53.34,23.18 58.05,23.18
  Top 1.219: 58.05,23.18 60.32,20.91 60.32,18.17 D2.A 63.43,15.31 JP29.2
SIDELIGHTS  (via drill 0.35)
  Top 0.508: 36.2,14.25 36.2,8.69
  Top 0.61: 36.2,8.69 35.78,8.2 28.52,8.2 27.29,7 27.31,6.98 JP24.2 | 36.2,14.25 34.91,15.54 | IC3.10 26.67,23.18 27.62,22.23 28.52,22.23 31.18,19.56 31.18,16.45 32.09,15.54 34.91,15.54 | v38.1,18.73 34.91,15.54
  Top 0.813: JP23.2 JP24.2
  Bottom 0.61: v38.1,18.73 39,19.63 39,21.19 44.13,26.31 | JP33.1 57.17,22.23 53.08,26.31 44.13,26.31 | JP20.6 63.18,42.54 52.98,32.34 50.15,32.34 44.13,26.31
TAILLIGHTS  (via drill 0.35)
  Top 0.61: R28.1 v52.71,33.66 49.9,30.85 45.6,30.85 41.03,26.28 32.47,26.28 29.49,29.26 22.42,29.26 19.05,25.89 IC3.16
  Bottom 0.61: JP20.3 68.31,41.64 68.31,43.41 66.64,45.09 64.14,45.09 v52.7,33.66 v52.71,33.66

### Text on the board
tNames: CH7 | CH1 | CH2 | CH3 | CH4 | ESC | IN1 | IN2 | IN3 | RX | GND | 5V | +V | +V | Sig | Max. 3.3V! | GPIO0 | SL | 5V | Volume | IL | TL | Rearlights | IR | REV | REV* | 5V | IL | !! ALWAYS USE SERIES RESISTORS FOR LED, PAY ATTENTION TO POLARITY !! | GND | SL* | 5V | TAMIYA trailer 56502 | TheDIYGuy999 / ESP32 RC / Sound & Light / Controller SMD / 30 Pin V1.2 | IR | 5V | TL | 5V | Shaker | 7-12.6V | OUT | Common / Positive! | SPI LCD dashboard | 5V | IL | IR | FOGL | ROOFL | SIDEL | B2 | B1 | HEADL | CL | GND | 3V3 | SCL | SDA | RES | DC | CS
bNames: Remove jumper / if ESC with BEC / is connected!! | https://github.com/TheDIYGuy999/Rc_Engine_Sound_ESP32 | Modified by PHL 02-2025 | Trailer mode / use R for / REV & SL ! | * | TheDIY / Guy999 | TAMIYA